# EasyEDA schematic SCH_18f4550_2023-06-13.json
TITLE: Sheet_1; REV: 1.0; Date: 2023-01-19; Sheet: 1/1; Drawn By: bigjohnson; Company: Your Company
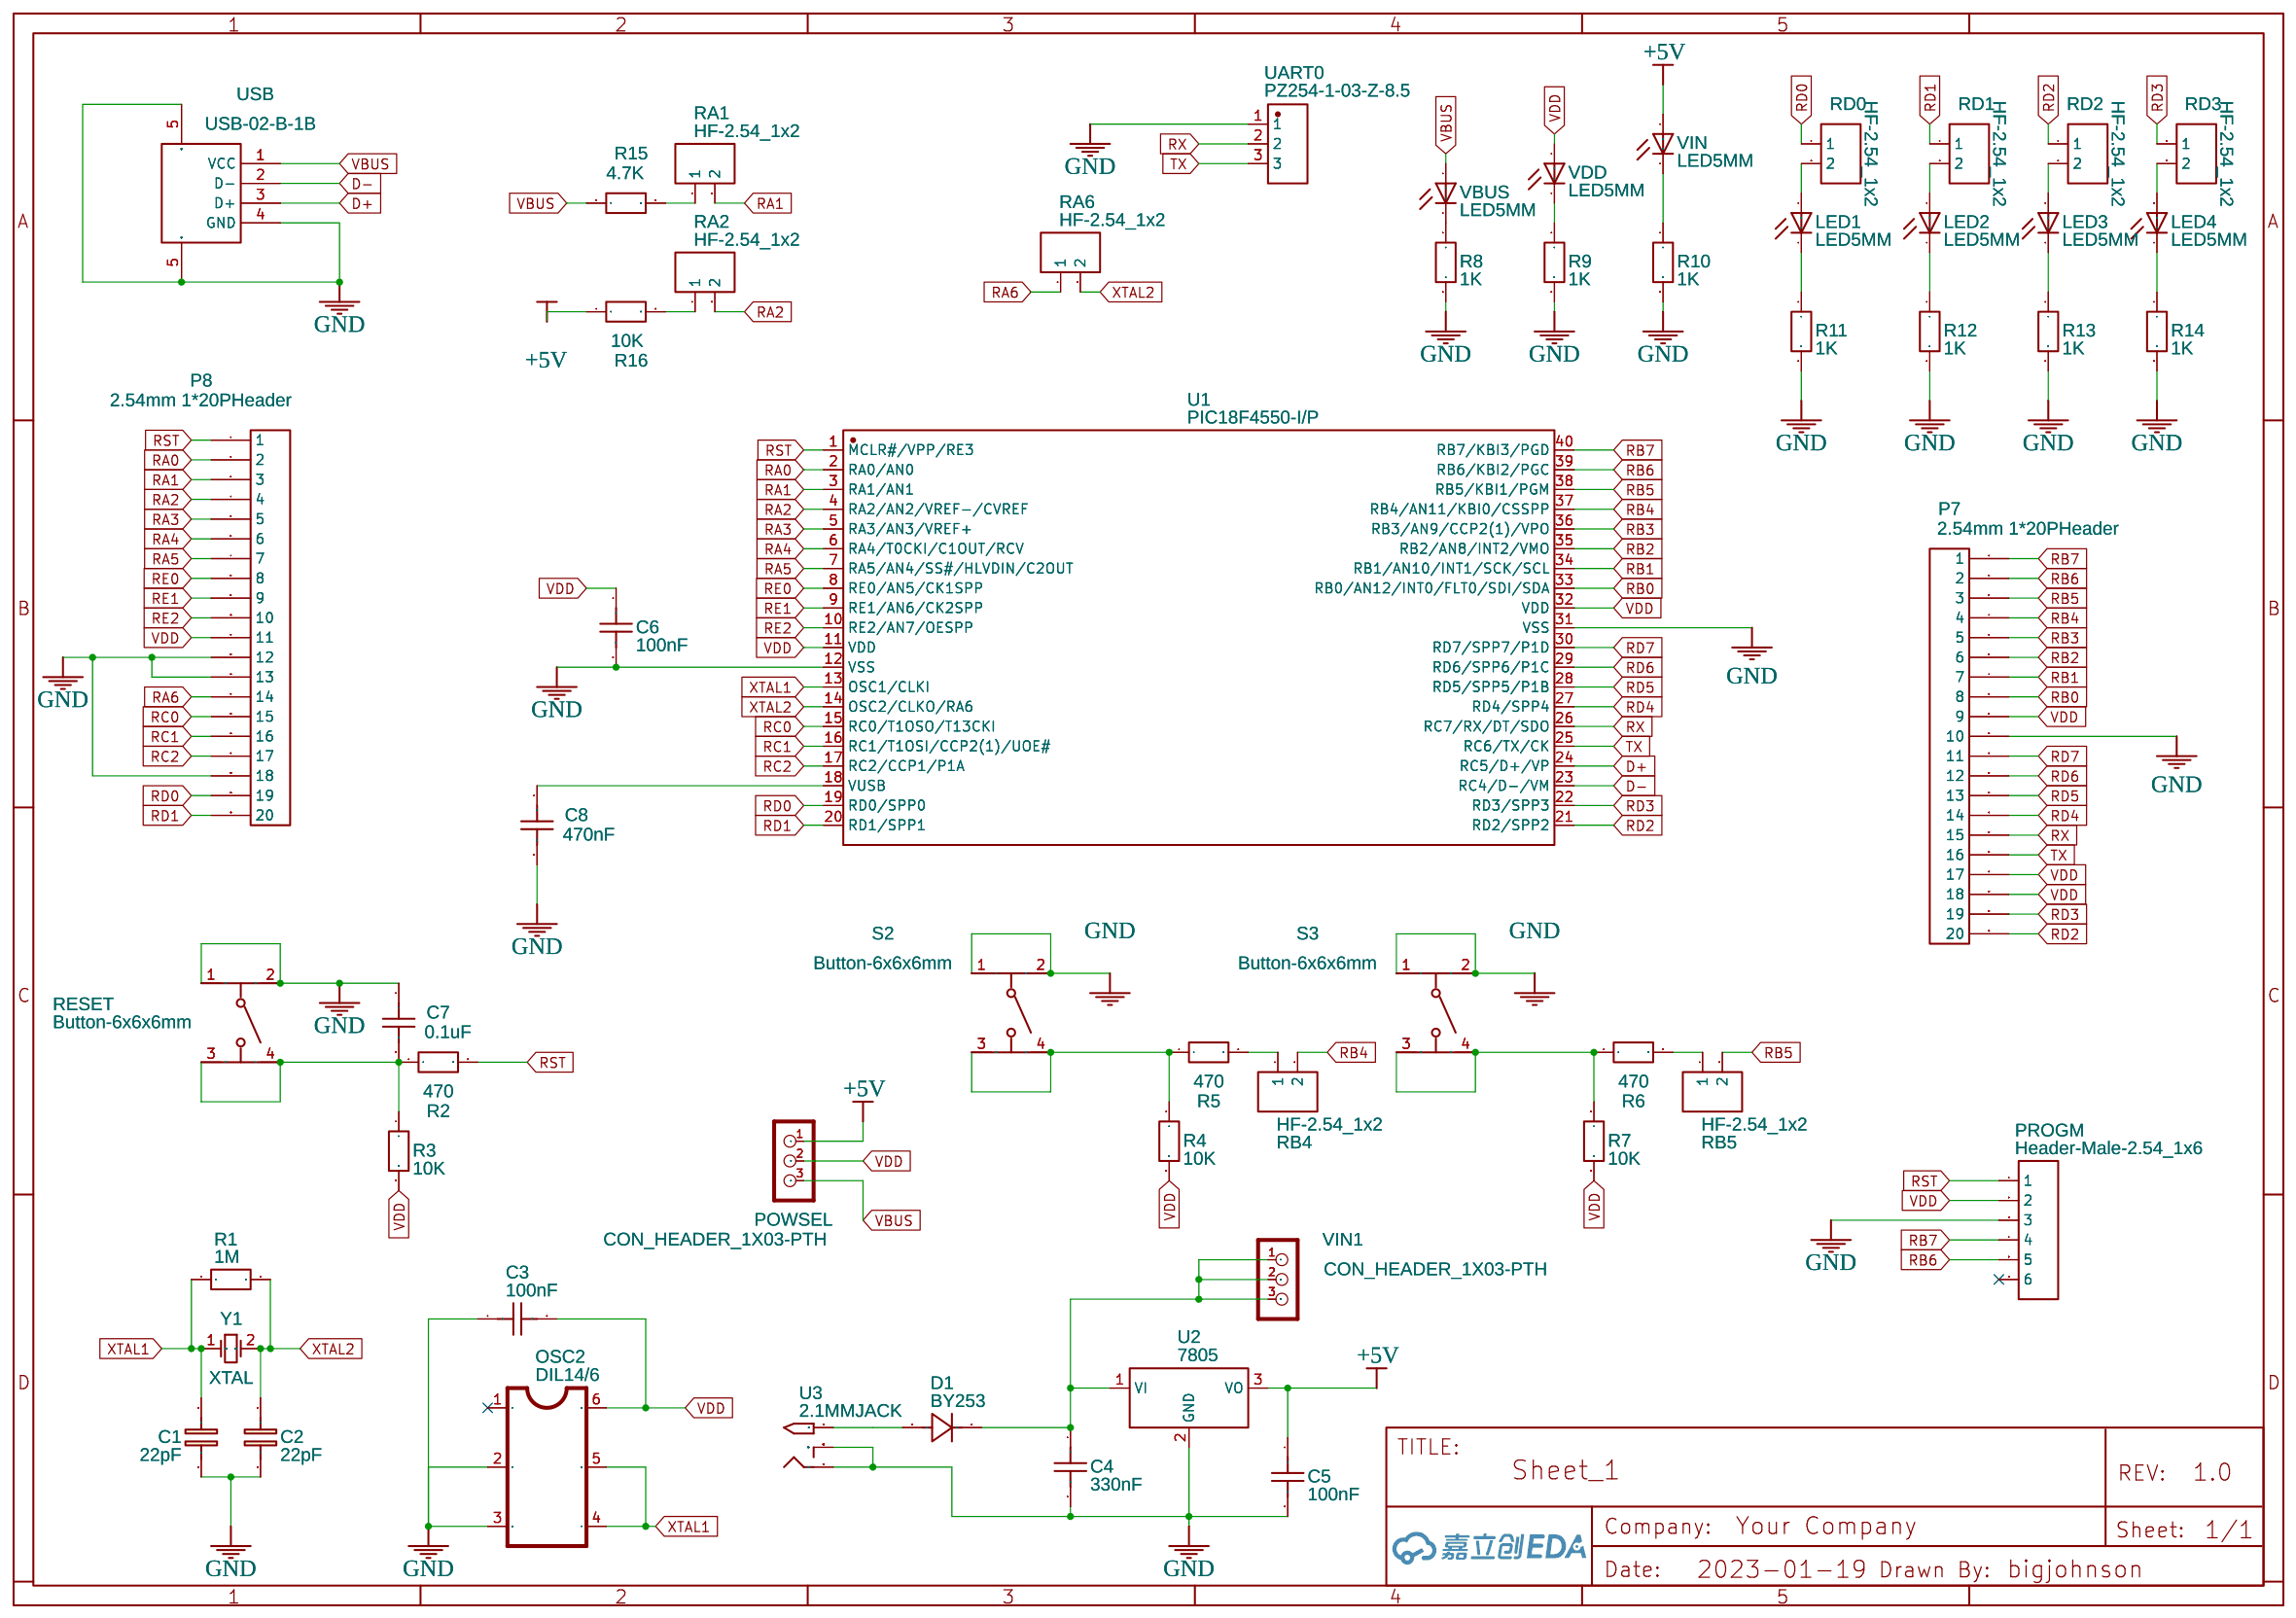
[diagram p0: schematic sheet]

## Parts
C1  22pF  [CAPASITOR (K10-17Б), 15PF, 50V, 10%]
C2  22pF  [CAPASITOR (K10-17Б), 15PF, 50V, 10%]
C3  100nF  [CAP-TH_L4.2-W3.8-P5.08-D0.6]
C4  330nF  [CAP-TH_L4.2-W3.8-P5.08-D0.6]
C5  100nF  [CAP-TH_L4.2-W3.8-P5.08-D0.6]
C6  100nF  [CAP-TH_L4.2-W3.8-P5.08-D0.6]
C7  0.1uF  [CAP-TH_L4.2-W3.8-P5.08-D0.6]
C8  470nF  [CAP-TH_L4.2-W3.8-P5.08-D0.6]
D1  BY253  [DO-201_BD5.1-L8.4-P15.24-D1.0-RD]
LED1  LED5MM  [LED5MM]
LED2  LED5MM  [LED5MM]
LED3  LED5MM  [LED5MM]
LED4  LED5MM  [LED5MM]
OSC2  DIL14/6  [DIP14]
P7  2.54mm 1*20PHeader  [HDR-20X1/2.54]
P8  2.54mm 1*20PHeader  [HDR-20X1/2.54]
POWSEL  CON_HEADER_1X03-PTH  [M1X3]
PROGM  Header-Male-2.54_1x6  [HDR-TH_6P-P2.54-V-M-1]
R1  1M  [AXIAL-0.4]
R2  470  [AXIAL-0.4]
R3  10K  [AXIAL-0.4]
R4  10K  [AXIAL-0.4]
R5  470  [AXIAL-0.4]
R6  470  [AXIAL-0.4]
R7  10K  [AXIAL-0.4]
R8  1K  [AXIAL-0.4]
R9  1K  [AXIAL-0.4]
R10  1K  [AXIAL-0.4]
R11  1K  [AXIAL-0.4]
R12  1K  [AXIAL-0.4]
R13  1K  [AXIAL-0.4]
R14  1K  [AXIAL-0.4]
R15  4.7K  [AXIAL-0.4]
R16  10K  [AXIAL-0.4]
RA1  HF-2.54_1x2  [HDR-TH_2P-P2.54-V-F]
RA2  HF-2.54_1x2  [HDR-TH_2P-P2.54-V-F]
RA6  HF-2.54_1x2  [HDR-TH_2P-P2.54-V-F]
RB4  HF-2.54_1x2  [HDR-TH_2P-P2.54-V-F]
RB5  HF-2.54_1x2  [HDR-TH_2P-P2.54-V-F]
RD0  HF-2.54_1x2  [HDR-TH_2P-P2.54-V-F]
RD1  HF-2.54_1x2  [HDR-TH_2P-P2.54-V-F]
RD2  HF-2.54_1x2  [HDR-TH_2P-P2.54-V-F]
RD3  HF-2.54_1x2  [HDR-TH_2P-P2.54-V-F]
RESET  Button-6x6x6mm  [SW-TH_4P-L6.0-W6.0-P4.50-LS6.1]
S2  Button-6x6x6mm  [SW-TH_4P-L6.0-W6.0-P4.50-LS6.1]
S3  Button-6x6x6mm  [SW-TH_4P-L6.0-W6.0-P4.50-LS6.1]
U1  PIC18F4550-I/P  [PDIP-40_L52.3-W13.8-P2.54-LS15.2-BL]
U2  7805  [TO-220]
U3  2.1MMJACK  [PJ-102A]
UART0  PZ254-1-03-Z-8.5  [HDR-TH_03P-P2.54-V-M]
USB  USB-02-B-1B  [USB-B-TH_USB-02-B-1X]
VBUS  LED5MM  [LED5MM]
VDD  LED5MM  [LED5MM]
VIN  LED5MM  [LED5MM]
VIN1  CON_HEADER_1X03-PTH  [M1X3]
Y1  XTAL  [XTAL1]

## Library data of the parts
C1 C2 = 20pF copy: Supplier Part: 9000274010; Contributor: seldomorama; link: https://www.chipdip.ru/product0/9000447523
C3-C8 = CT4-0805B103 K500: Supplier: LCSC; Manufacturer: ReliaPro; Supplier Part: C8033
D1 = MUR460_C2990844: Supplier: LCSC; Supplier Part: C2990844; Manufacturer: GOOD-ARK(固锝); Manufacturer Part: MUR460; JLCPCB Part Class: Extended Part; Contributor: lcsc
LED1-LED4 VBUS VDD VIN = LED5MM: LEDs; Contributor: Pinoccio
OSC2 = DIL14/3: Universal 14pins IC; Contributor: bigjohnson
P7 P8 = 2.54mm 1*20PHeader: Supplier Part: C50981; Supplier: LCSC; Manufacturer: BOOMELE; image: //image.lceda.cn/szlcsc/C50981.jpg
POWSEL VIN1 = CON_HEADER_1X03-PTH: Contributor: DangerousPrototype
PROGM = Header-Male-2.54_1x6: Supplier: LCSC; Manufacturer: BOOMELE(博穆精密); Manufacturer Part: 2.54-1x6P直针; Supplier Part: C37208; JLCPCB Part Class: Extended Part
R1-R16 = Res_AXIAL-0.4(1/4W)_EU
RA1 RA2 RA6 RB4 RB5 RD0-RD3 = Header-Female-2.54_1x2: Supplier: LCSC; Manufacturer: BOOMELE(博穆精密); Manufacturer Part: 2.54-1*2P母; Supplier Part: C49661; JLCPCB Part Class: Extended Part
RESET S2 S3 = Button-6x6x6mm: Supplier Part: C71836; Supplier: LCSC; Manufacturer: BBJ; Manufacturer Part: Switch,6*6*6Plastic head,260G, 0.25mm,Straight line
U1 = PIC18F4550-I/P: Supplier: LCSC; Supplier Part: C648001; Manufacturer: MICROCHIP(美国微芯); Contributor: LCSC; JLCPCB Part Class: Extended Part
U2 = 7805: Supplier: LCSC; Supplier Part: C305416; Manufacturer: Foshan Blue Rocket Elec; Contributor: Gerardo Trejo-Larin
U3 = 2.1MMJACK: Contributor: Adafruit
UART0 = PZ254-1-03-Z-8.5: Supplier: LCSC; Supplier Part: C2894926; Manufacturer: HCTL(华灿天禄); Contributor: LCSC; JLCPCB Part Class: Extended Part
USB = USB-02-B-1B: Supplier: LCSC; Supplier Part: C718028; Manufacturer: JINJIA; Contributor: LCSC; JLCPCB Part Class: Extended Part
Y1 = XTAL: Crystal Oscillator

## Nets
+5V: C5.1 POWSEL.1 R16.1 U2.3(VO) VIN.A
GND: C1.2(1) C2.2(1) C3.1 C4.2 C5.2 C6.2 C7.1 C8.2 OSC2.2 OSC2.3 P7.10 P8.12 P8.13 P8.18 PROGM.3 R8.2 R9.2 R10.2 R11.2 R12.2 R13.2 R14.2 RESET.1 RESET.2 S2.1 S2.2 S3.1 S3.2 U1.12(VSS) U1.31(VSS) U2.2(GND) U3.RING U3.RING_SW UART0.1 USB.4(GND) USB.5(SHLD)
VBUS: POWSEL.3 R15.1 USB.1(VCC) VBUS.A
VDD: C3.2 C6.1 OSC2.6 P7.9 P7.17 P7.18 P8.11 POWSEL.2 PROGM.2 R3.2 R4.2 R7.2 U1.11(VDD) U1.32(VDD) VDD.A
D+: U1.24(RC5/D+/VP) USB.3(D+)
D-: U1.23(RC4/D-/VM) USB.2(D-)
RA0: P8.2 U1.2(RA0/AN0)
RA1: P8.3 RA1.2 U1.3(RA1/AN1)
RA2: P8.4 RA2.2 U1.4(RA2/AN2/VREF-/CVREF)
RA3: P8.5 U1.5(RA3/AN3/VREF+)
RA4: P8.6 U1.6(RA4/T0CKI/C1OUT/RCV)
RA5: P8.7 U1.7(RA5/AN4/SS#/HLVDIN/C2OUT)
RA6: P8.14 RA6.1
RB0: P7.8 U1.33(RB0/AN12/INT0/FLT0/SDI/SDA)
RB1: P7.7 U1.34(RB1/AN10/INT1/SCK/SCL)
RB2: P7.6 U1.35(RB2/AN8/INT2/VMO)
RB3: P7.5 U1.36(RB3/AN9/CCP2(1)/VPO)
RB4: P7.4 RB4.2 U1.37(RB4/AN11/KBI0/CSSPP)
RB5: P7.3 RB5.2 U1.38(RB5/KBI1/PGM)
RB6: P7.2 PROGM.5 U1.39(RB6/KBI2/PGC)
RB7: P7.1 PROGM.4 U1.40(RB7/KBI3/PGD)
RC0: P8.15 U1.15(RC0/T1OSO/T13CKI)
RC1: P8.16 U1.16(RC1/T1OSI/CCP2(1)/UOE#)
RC2: P8.17 U1.17(RC2/CCP1/P1A)
RD0: P8.19 RD0.1 U1.19(RD0/SPP0)
RD1: P8.20 RD1.1 U1.20(RD1/SPP1)
RD2: P7.20 RD2.1 U1.21(RD2/SPP2)
RD3: P7.19 RD3.1 U1.22(RD3/SPP3)
RD4: P7.14 U1.27(RD4/SPP4)
RD5: P7.13 U1.28(RD5/SPP5/P1B)
RD6: P7.12 U1.29(RD6/SPP6/P1C)
RD7: P7.11 U1.30(RD7/SPP7/P1D)
RE0: P8.8 U1.8(RE0/AN5/CK1SPP)
RE1: P8.9 U1.9(RE1/AN6/CK2SPP)
RE2: P8.10 U1.10(RE2/AN7/OESPP)
RST: P8.1 PROGM.1 R2.2 U1.1(MCLR#/VPP/RE3)
RX: P7.15 U1.26(RC7/RX/DT/SDO) UART0.2
TX: P7.16 U1.25(RC6/TX/CK) UART0.3
XTAL1: C1.1 OSC2.4 OSC2.5 R1.1 U1.13(OSC1/CLKI) Y1.1(OSC1)
XTAL2: C2.1 R1.2 RA6.2 U1.14(OSC2/CLKO/RA6) Y1.2(OSC2)
Net-(C4-1): C4.1 D1.1(K) U2.1(VI) VIN1.1 VIN1.2 VIN1.3
Net-(C7-2): C7.2 R2.1 R3.1 RESET.3 RESET.4
Net-(C8-1): C8.1 U1.18(VUSB)
Net-(D1-2): D1.2(A) U3.TIP
Net-(LED1-A): LED1.A RD0.2
Net-(LED1-K): LED1.K(C) R11.1
Net-(LED2-A): LED2.A RD1.2
Net-(LED2-K): LED2.K(C) R12.1
Net-(LED3-A): LED3.A RD2.2
Net-(LED3-K): LED3.K(C) R13.1
Net-(LED4-A): LED4.A RD3.2
Net-(LED4-K): LED4.K(C) R14.1
Net-(R4-1): R4.1 R5.1 S2.3 S2.4
Net-(R5-2): R5.2 RB4.1
Net-(R6-1): R6.1 R7.1 S3.3 S3.4
Net-(R6-2): R6.2 RB5.1
Net-(R8-1): R8.1 VBUS.K(C)
Net-(R9-1): R9.1 VDD.K(C)
Net-(R10-1): R10.1 VIN.K(C)
Net-(R15-2): R15.2 RA1.1
Net-(R16-2): R16.2 RA2.1

Not connected (* = marked no-connect by the designer): OSC2 1*; PROGM 6*
